# EAGLE design USB breakout (EAGLE 7.3.0)
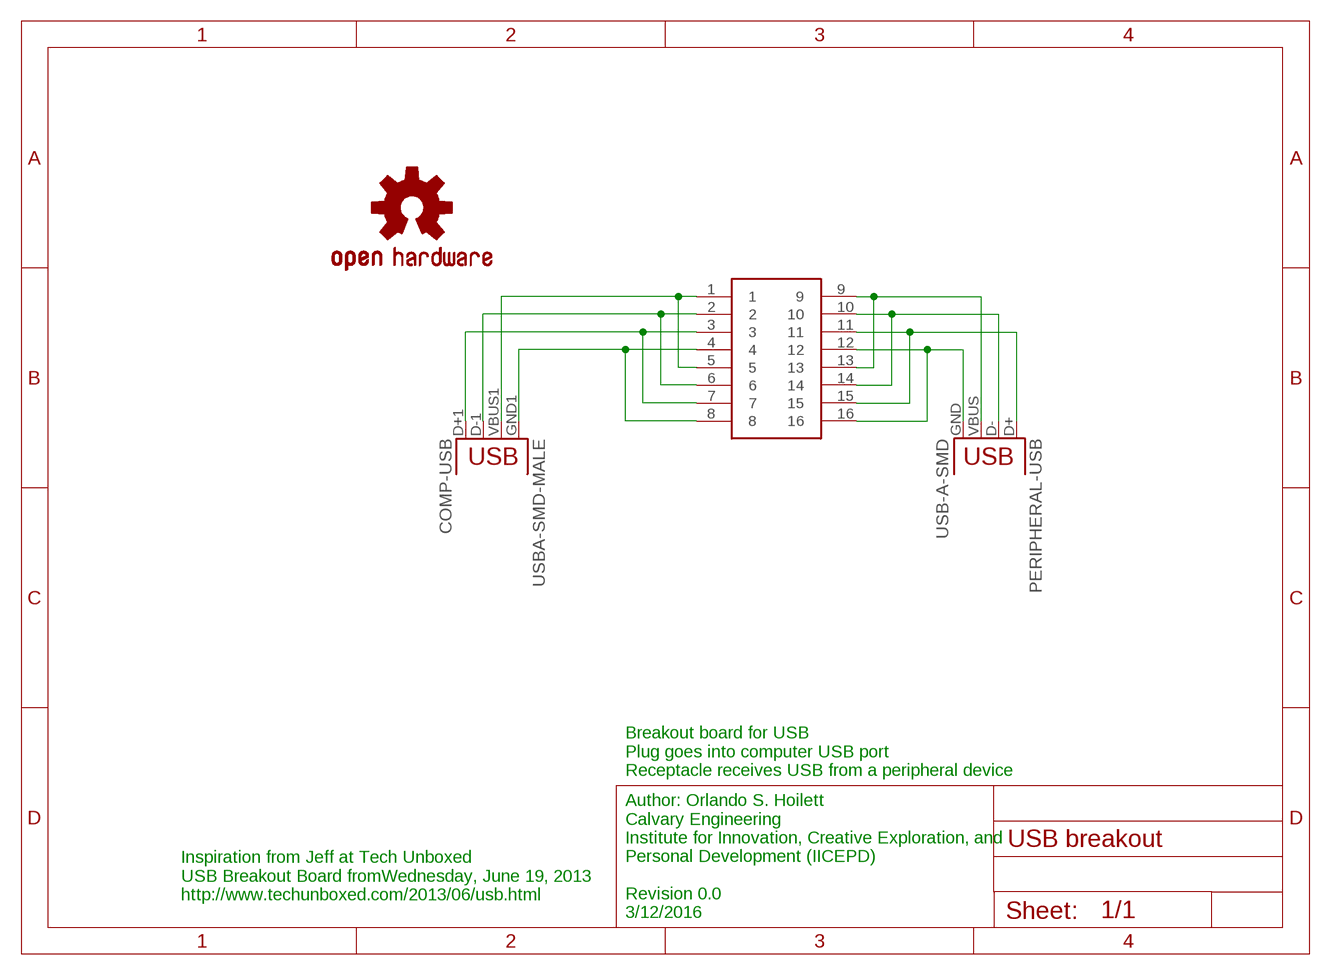
[diagram p0: schematic, sheet 1]

## Parts
COMP-USB  USBA-SMD-MALE  [USB-A-SMT-MALE]
LOGO1  OSHW-LOGOS  [OSHW-LOGO-S]
PERIPHERAL-USB  USB-A-SMD  [USB-A-S-NOSILK-FEMALE]
U$1  MX4X4  [M04X4]

## Nets
C-D+: COMP-USB.D+1(D+) U$1.3 U$1.7
C-D-: COMP-USB.D-1(D-) U$1.2 U$1.6
C-GND: COMP-USB.GND1(GND) U$1.4 U$1.8
C-V+: COMP-USB.VBUS1(VBUS) U$1.1 U$1.5
P-D+: PERIPHERAL-USB.D+ U$1.11 U$1.15
P-D-: PERIPHERAL-USB.D- U$1.10 U$1.14
P-GND: PERIPHERAL-USB.GND U$1.12 U$1.16
P-V+: PERIPHERAL-USB.VBUS U$1.9 U$1.13

## Notes on the sheet
- Breakout board for USB
  Plug goes into computer USB port
  Receptacle receives USB from a peripheral device
- Inspiration from Jeff at Tech Unboxed
  USB Breakout Board fromWednesday, June 19, 2013
  http://www.techunboxed.com/2013/06/usb.html
- Author: Orlando S. Hoilett
  Calvary Engineering
  Institute for Innovation, Creative Exploration, and
  Personal Development (IICEPD)
  
  Revision 0.0
  3/12/2016

## Library data of the parts
COMP-USB = SparkFun-Connectors:USB: USB Connectors USB-B-PTH is fully proven SKU : PRT-00139/CONN-08278 USB-miniB is fully proven SKU : PRT-00587 USB-A-PCB is untested. USB-A-H is throughly reviewed, but untested. Spark Fun Electronics SKU : PRT-00437 USB-B-SMT is throughly reviewed, but untested. Needs silkscreen touching up. USB-A-S has not been used/tested USB-MB-H has not been used/tested USB-MICROB has been used. CONN-09505
LOGO1 = SparkFun-Aesthetics:OSHW-LOGO: Open Source Hardware Logo This logo indicates the piece of hardware it is found on incorporates a OSHW license and/or adheres to the definition of open source hardware found here: http://freedomdefined.org/OSHW
PERIPHERAL-USB = SparkFun-Connectors:USB: USB Connectors USB-B-PTH is fully proven SKU : PRT-00139/CONN-08278 USB-miniB is fully proven SKU : PRT-00587 USB-A-PCB is untested. USB-A-H is throughly reviewed, but untested. Spark Fun Electronics SKU : PRT-00437 USB-B-SMT is throughly reviewed, but untested. Needs silkscreen touching up. USB-A-S has not been used/tested USB-MB-H has not been used/tested USB-MICROB has been used. CONN-09505; PROD_ID: CONN-09520
U$1 = Orlando:MX4X4

## Board
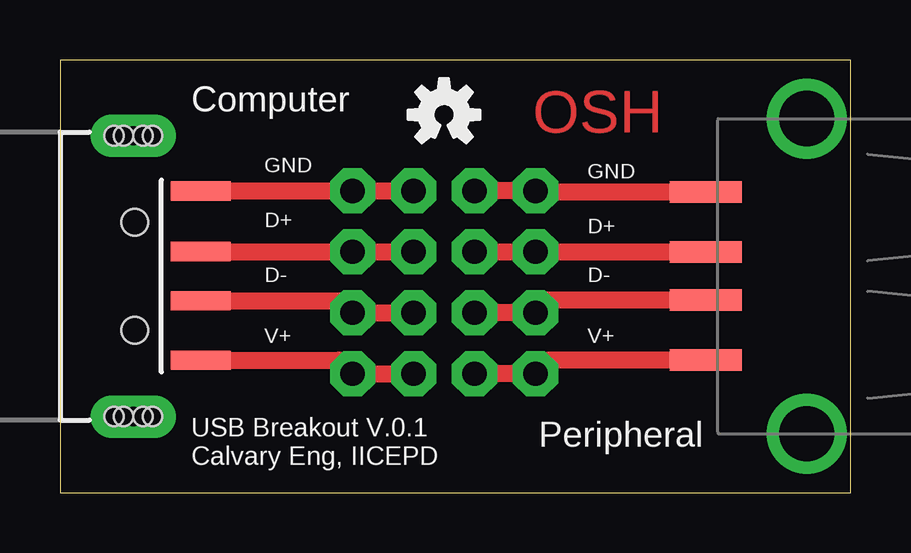
[diagram p1: board, top side]

Size 32.94 x 18.02 mm. Coordinates in mm from the lower left corner, seen from the top.
Outline: 0,0 32.94,0 32.94,18.02 0,18.02 0,0
Copper layers (1*16): Top 0.035mm / dielectric 1.5mm / Bottom 0.035mm
Design rules "default": minimum track width 10mil, minimum drill 24mil, track to track 8mil, track to pad 8mil, pad to pad 8mil, via to via 8mil, smd to smd 8mil, copper to edge 40mil, drill to drill 8mil, minimum pad ring 10mil, minimum via ring 8mil, stop-mask expansion 4mil, vias tented up to drill 0mil, thermal gap 10mil

### Footprints (pad centres in the part's own frame; a part is rotated, then mirrored left to right if it is on the bottom)
USB-A-SMT-MALE = smd 0.8 x 2.5: D+1 1.027,-5.87; D-1 -1.027,-5.87; GND1 3.551,-5.87; VBUS1 -3.5,-5.87 | drill 0.8 pad 1.778 long: P$1 5.85,-3.05; P$3 -5.85,-3.05 | hole 1.1: 2.25,-3.12; -2.25,-3.12 | hole 0.8: -5.85,-3.45; -5.85,-3.85; -5.85,-2.65; -5.85,-2.25; 5.85,-3.45; 5.85,-3.85; 5.85,-2.65; 5.85,-2.25
USB-A-S-NOSILK-FEMALE = smd 3 x 0.9: D+ 4.212,-1; D- 4.212,1; GND 4.212,-3.5; VBUS 4.212,3.5 | drill 2.311: S1 0,-6.566; S2 0,6.566
M04X4 = drill 1.016 pad 1.88 octagon: 1 -2.54,5.08; 2 0,5.08; 3 2.54,5.08; 4 5.08,5.08; 5 -2.54,2.54; 6 0,2.54; 7 2.54,2.54; 8 5.08,2.54; 9 -2.54,0; 10 0,0; 11 2.54,0; 12 5.08,0; 13 -2.54,-2.54; 14 0,-2.54; 15 2.54,-2.54; 16 5.08,-2.54

### Placement (x,y rotation side)
COMP-USB  0,9.02 90 top
LOGO1  16,15.75 0 top
PERIPHERAL-USB  31.11,9.02 180 top
U$1  17.27,7.49 90 top

### Tracks (layer width: path | path; a pad name or v marks a point on that pad's centre or on a via)
C-D+
  Top 0.711: COMP-USB.D+1 U$1.3 U$1.7
C-D-
  Top 0.711: COMP-USB.D-1 11.7,7.99 U$1.2 U$1.6
C-GND
  Top 0.711: COMP-USB.GND1 U$1.4 U$1.8
C-V+
  Top 0.711: COMP-USB.VBUS1 11.63,5.52 U$1.1 U$1.5
P-D+
  Top 0.711: PERIPHERAL-USB.D+ 19.83,10.02 | 19.83,10.02 U$1.15 | 19.83,10.02 17.29,10.02 U$1.11
P-D-
  Top 0.711: PERIPHERAL-USB.D- 20.34,8.02 U$1.14 U$1.10
P-GND
  Top 0.711: PERIPHERAL-USB.GND 19.87,12.52 U$1.16 U$1.12
P-V+
  Top 0.711: PERIPHERAL-USB.VBUS 20.38,5.52 U$1.13 U$1.9

### Text on the board
Top: OSH
tNames: Computer | GND | GND | D+ | D+ | D- | D- | V+ | V+ | Peripheral | USB Breakout V.0.1 / Calvary Eng, IICEPD